# EAGLE schematic FDTI2DMX (EAGLE 6.4)
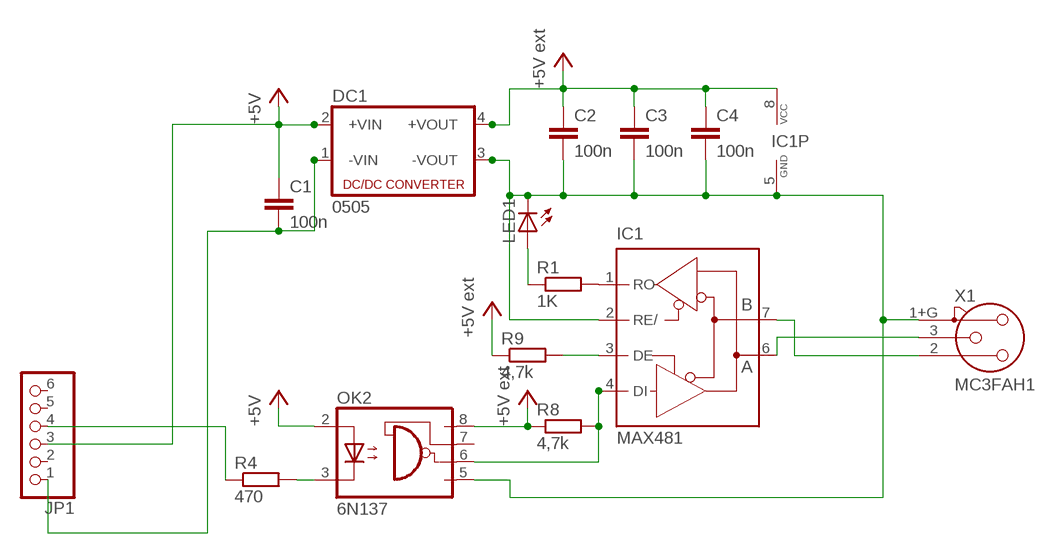
[diagram p0: schematic, sheet 1]

## Parts
C1  100n  C5/3  [C5B3]
C2  100n  C7.5/3  [C7.5B3]
C3  100n  C7.5/3  [C7.5B3]
C4  100n  C7.5/3  [C7.5B3]
DC1  0505  NME  [NME]
IC1  MAX481  MAX481CPA  [DIL08]
JP1  PINHD-1X6/90  [1X06/90]
LED1  LED3MM  [LED3MM]
OK2  6N137  [DIL08]
R1  1K  R-EU_0207/10  [0207/10]
R4  470  R-EU_0207/10  [0207/10]
R8  4,7k  R-EU_0204/7  [0204/7]
R9  4,7k  R-EU_0204/7  [0204/7]
X1  MC3FAH1  [NC3FAH1]

## Nets
+5V: C1.1 DC1.2(+VIN) JP1.3 OK2.2(A)
+5V_EXT: C2.1 C3.1 C4.1 DC1.4(+VOUT) IC1.8(VCC) OK2.8(VCC) R8.1 R9.1 ; supply symbol labelled +5V ext
GND_EXT: C2.2 C3.2 C4.2 DC1.3(-VOUT) IC1.2(RE/) IC1.5(GND) LED1.K(C) OK2.5(GND) X1.1+G
N$1: JP1.4 R4.1
N$2: IC1.6(A) X1.3
N$3: IC1.7(B) X1.2
N$4: IC1.1(RO) R1.2
N$5: OK2.3(C) R4.2
N$6: IC1.3(DE) R9.2
N$7: IC1.4(DI) OK2.6(VO) R8.2
N$8: C1.2 DC1.1(-VIN) JP1.1
N$9: LED1.A R1.1
Unconnected: JP1.2 JP1.5 JP1.6 OK2.7(VE)

## Library data of the parts
C1-C4 = capacitor-wima:C: CAPACITOR naming: grid - package width
DC1 = dc-dc-converter:NME: DC-DC CONVERTER; MF: C & D TECHNOLOGIES, INC; MPN: NME1205D; OC_FARNELL: 1021466; OC_NEWARK: 98B8198
IC1 = maxim:MAX481CPA: RS485 TRANSEIVER; MPN: MAX481CPA+; OC_FARNELL: unknown; OC_NEWARK: 99K3445
JP1 = pinhead:PINHD-1X6: PIN HEADER
LED1 = led:LED: LED OSRAM: - CHIPLED LG R971, LG N971, LY N971, LG Q971, LY Q971, LO R971, LY R971 LH N974, LH R974 LS Q976, LO Q976, LY Q976 LO Q996 - Hyper CHIPLED LW Q18S LB Q993, LB Q99A, LB R99A - SideLED LS A670, LO A670, LY A670, LG A670, LP A670 LB A673, LV A673, LT A673, LW A673 LH A674 LY A675 LS A676, LA A676, LO A676, LY A676, LW A676 LS A679, LY A679, LG A679 - Hyper Micro SIDELED® LS Y876, LA Y876, LO Y876, LY Y876 LT Y87S - SmartLED LW L88C, LW L88S LB L89C, LB L89S, LG L890 LS L89K, LO L89K, LY L89K LS L896, LA L896, LO L896, LY L896 - TOPLED LS T670, LO T670, LY T670, LG T670, LP T670 LSG T670, LSP T670, LSY T670, LOP T670, LYG T670 LG T671, LOG T671, LSG T671 LB T673, LV T673, LT T673, LW T673 LH T674 LS T676, LA T676, LO T676, LY T676, LB T676, LH T676, LSB T676, LW T676 LB T67C, LV T67C, LT T67C, LS T67K, LO T67K, LY T67K, LW E67C LS E67B, LA E67B, LO E67B, LY E67B, LB E67C, LV E67C, LT E67C LW T67C LS T679, LY T679, LG T679 LS T770, LO T770, LY T770, LG T770, LP T770 LB T773, LV T773, LT T773, LW T773 LH T774 LS E675, LA E675, LY E675, LS T675 LS T776, LA T776, LO T776, LY T776, LB T776 LHGB T686 LT T68C, LB T68C - Hyper Mini TOPLED® LB M676 - Mini TOPLED Santana® LG M470 LS M47K, LO M47K, LY M47K Source: http://www.osram.convergy.de LUXEON: - LUMILED® LXK2-PW12-R00, LXK2-PW12-S00, LXK2-PW14-U00, LXK2-PW14-V00 LXK2-PM12-R00, LXK2-PM12-S00, LXK2-PM14-U00 LXK2-PE12-Q00, LXK2-PE12-R00, LXK2-PE12-S00, LXK2-PE14-T00, LXK2-PE14-U00 LXK2-PB12-K00, LXK2-PB12-L00, LXK2-PB12-M00, LXK2-PB14-N00, LXK2-PB14-P00, LXK2-PB14-Q00 LXK2-PR12-L00, LXK2-PR12-M00, LXK2-PR14-Q00, LXK2-PR14-R00 LXK2-PD12-Q00, LXK2-PD12-R00, LXK2-PD12-S00 LXK2-PH12-R00, LXK2-PH12-S00 LXK2-PL12-P00, LXK2-PL12-Q00, LXK2-PL12-R00 Source: www.luxeon.com KINGBRIGHT: KA-3528ASYC Source: www.kingbright.com
OK2 = optocoupler:6N137: MOTOROLA OPTO COUPLER; MPN: 6N137; OC_FARNELL: 1328376; OC_NEWARK: 52M1895
R1 R4 R8 R9 = resistor:R-EU_: RESISTOR, European symbol
X1 = con-neutrik_ag:MC3?: Neutrik Audio Connector XLR SERIES Stereo 1/4" jack Source: www.neutrik.com/; OC_FARNELL: unknown; OC_NEWARK: unknown

## Net classes
1 power: width 0.508 mm